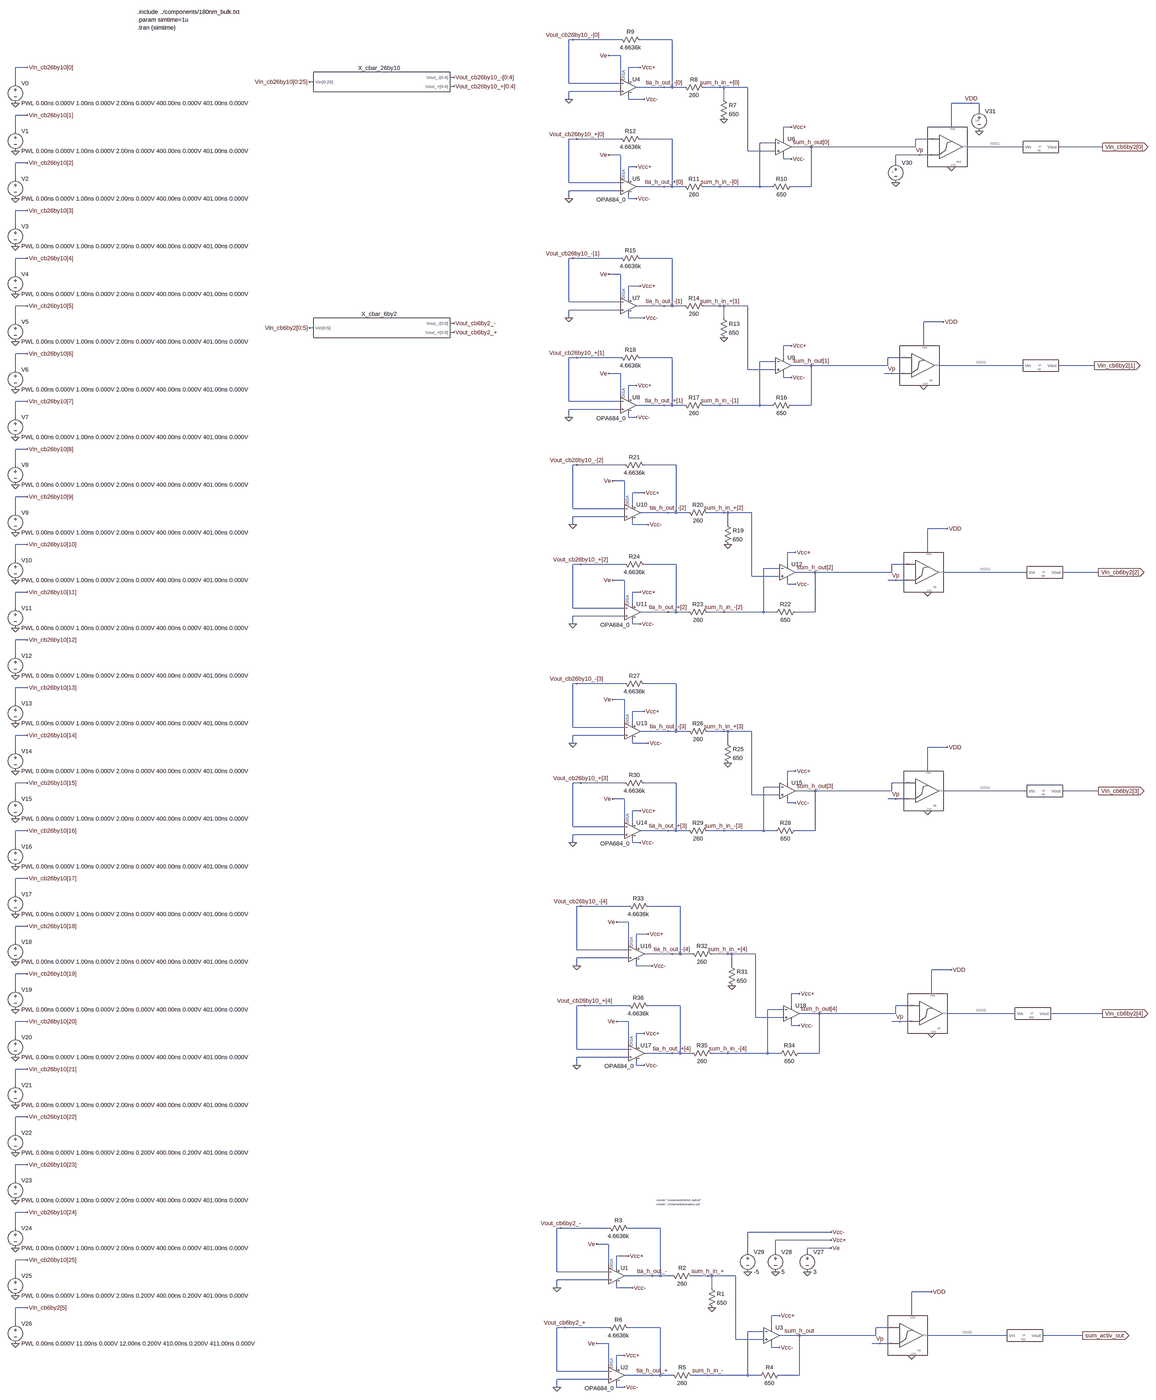
[diagram p0: schematic complete_circuit_generated_4.asc, whole sheet]
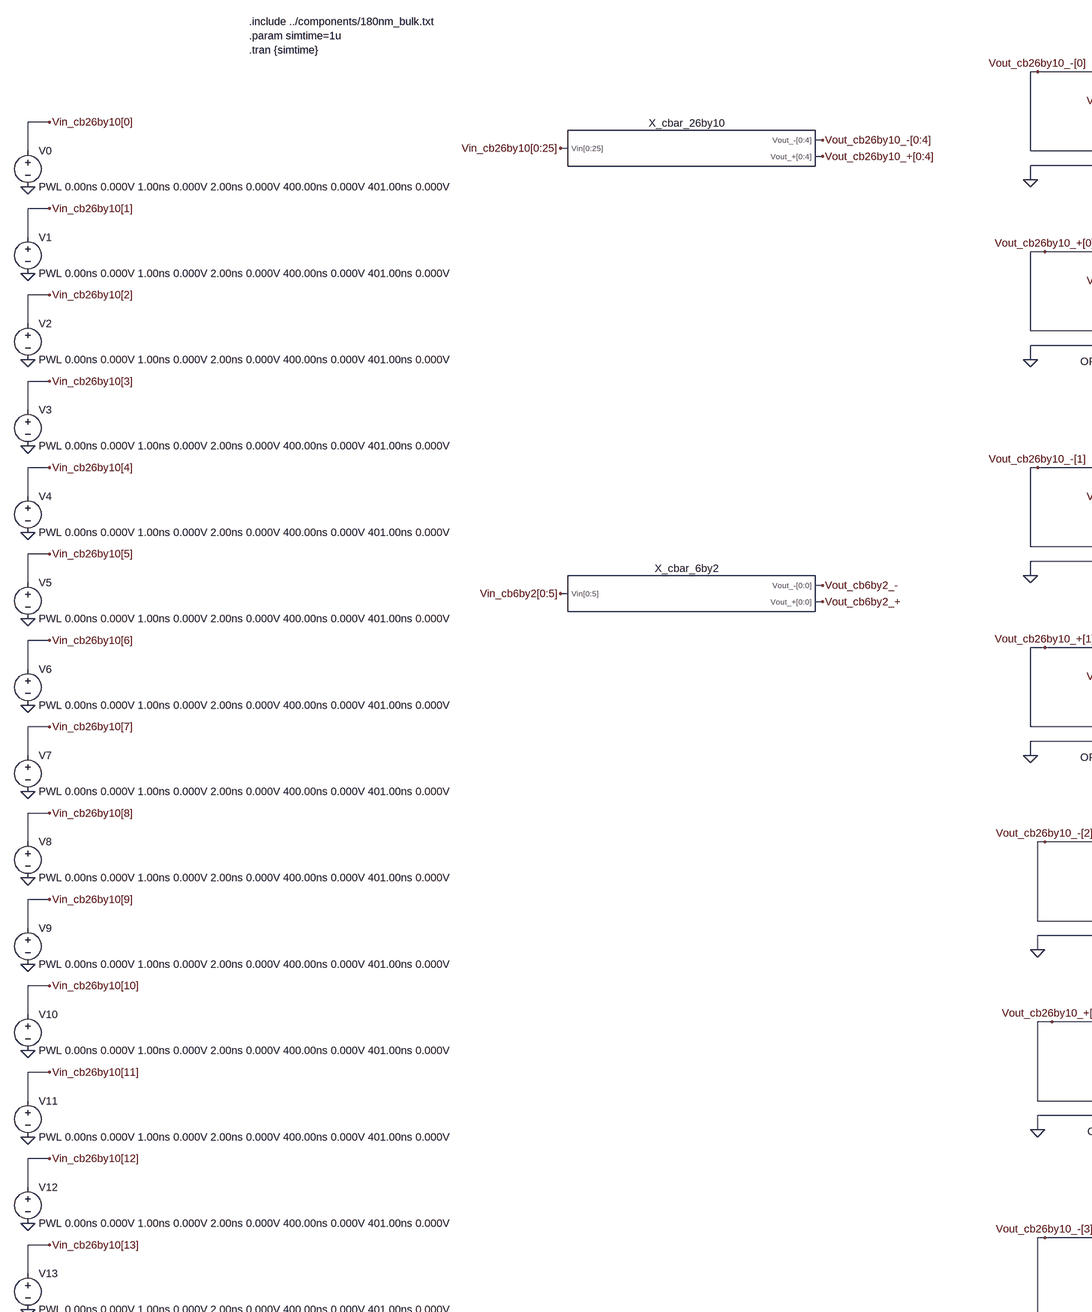
[diagram p1: schematic complete_circuit_generated_4.asc, part, row 1 of 2, column 1 of 2]
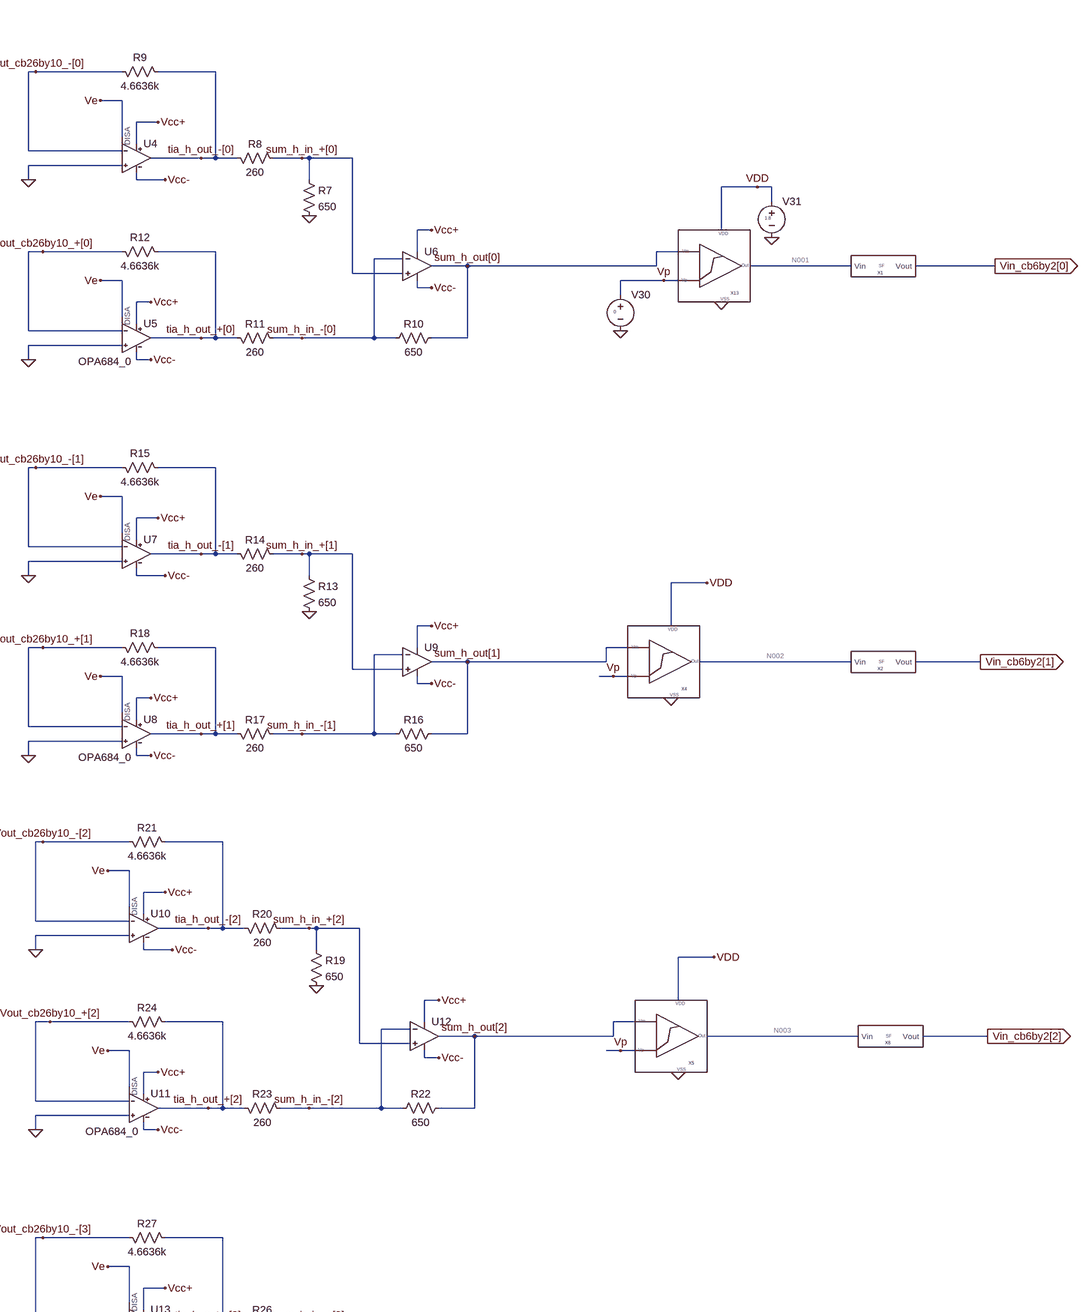
[diagram p2: schematic complete_circuit_generated_4.asc, part, row 1 of 2, column 2 of 2]
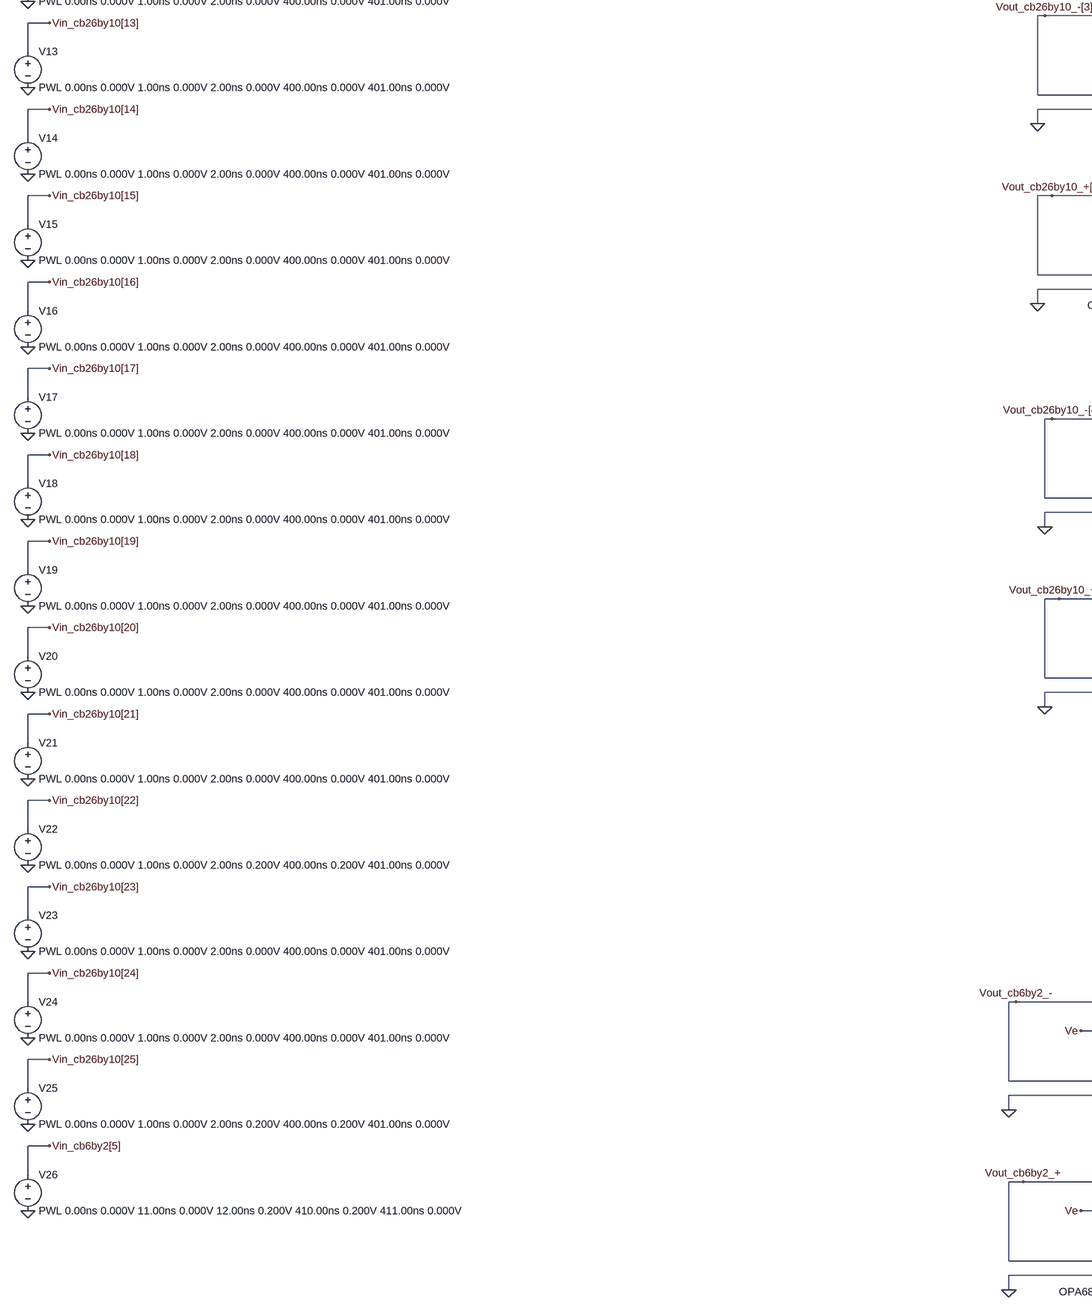
[diagram p3: schematic complete_circuit_generated_4.asc, part, row 2 of 2, column 1 of 2]
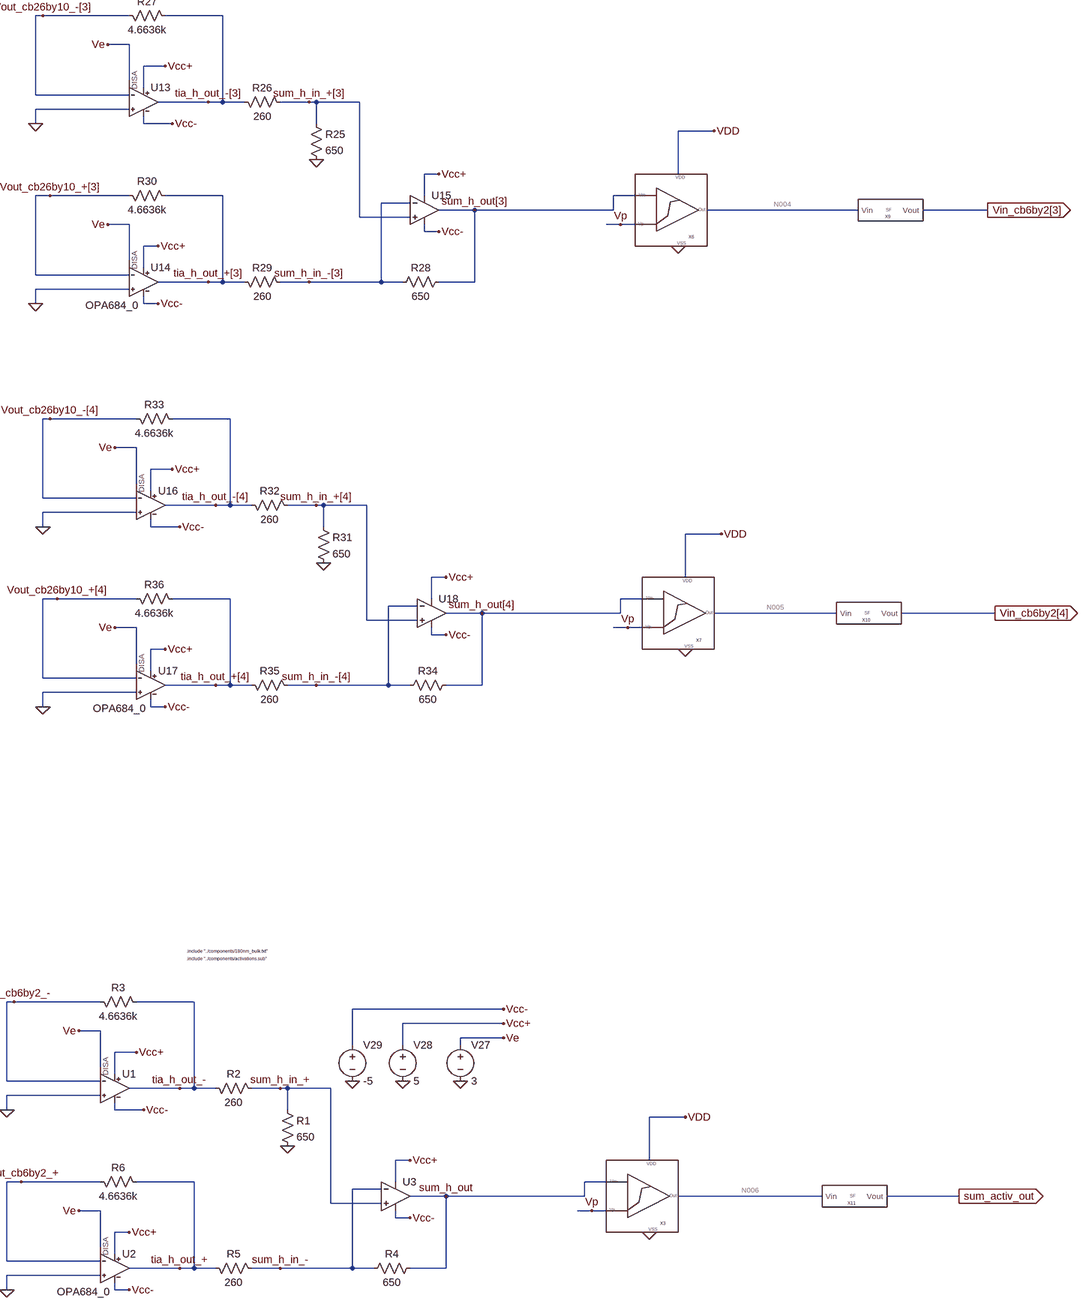
[diagram p4: schematic complete_circuit_generated_4.asc, part, row 2 of 2, column 2 of 2]
* complete_circuit_generated_4.asc
XX_cbar_26by10 Vin_cb26by10[0] Vin_cb26by10[1] Vin_cb26by10[2] Vin_cb26by10[3] Vin_cb26by10[4] Vin_cb26by10[5] Vin_cb26by10[6] Vin_cb26by10[7] Vin_cb26by10[8] Vin_cb26by10[9] Vin_cb26by10[10] Vin_cb26by10[11] Vin_cb26by10[12] Vin_cb26by10[13] Vin_cb26by10[14] Vin_cb26by10[15] Vin_cb26by10[16] Vin_cb26by10[17] Vin_cb26by10[18] Vin_cb26by10[19] Vin_cb26by10[20] Vin_cb26by10[21] Vin_cb26by10[22] Vin_cb26by10[23] Vin_cb26by10[24] Vin_cb26by10[25] Vout_cb26by10_+[0] Vout_cb26by10_+[1] Vout_cb26by10_+[2] Vout_cb26by10_+[3] Vout_cb26by10_+[4] Vout_cb26by10_-[0] Vout_cb26by10_-[1] Vout_cb26by10_-[2] Vout_cb26by10_-[3] Vout_cb26by10_-[4] X_cbar_26by10  ; pins Vin[0:25] Vout_+[0:4] Vout_-[0:4]
XX_cbar_6by2 Vin_cb6by2[0] Vin_cb6by2[1] Vin_cb6by2[2] Vin_cb6by2[3] Vin_cb6by2[4] Vin_cb6by2[5] Vout_cb6by2_+ Vout_cb6by2_- X_cbar_6by2  ; pins Vin[0:5] Vout_+[0:0] Vout_-[0:0]
V0 Vin_cb26by10[0] 0 PWL 0.00ns 0.000V 1.00ns 0.000V 2.00ns 0.000V 400.00ns 0.000V 401.00ns 0.000V
V1 Vin_cb26by10[1] 0 PWL 0.00ns 0.000V 1.00ns 0.000V 2.00ns 0.000V 400.00ns 0.000V 401.00ns 0.000V
V2 Vin_cb26by10[2] 0 PWL 0.00ns 0.000V 1.00ns 0.000V 2.00ns 0.000V 400.00ns 0.000V 401.00ns 0.000V
V3 Vin_cb26by10[3] 0 PWL 0.00ns 0.000V 1.00ns 0.000V 2.00ns 0.000V 400.00ns 0.000V 401.00ns 0.000V
V4 Vin_cb26by10[4] 0 PWL 0.00ns 0.000V 1.00ns 0.000V 2.00ns 0.000V 400.00ns 0.000V 401.00ns 0.000V
V5 Vin_cb26by10[5] 0 PWL 0.00ns 0.000V 1.00ns 0.000V 2.00ns 0.000V 400.00ns 0.000V 401.00ns 0.000V
V6 Vin_cb26by10[6] 0 PWL 0.00ns 0.000V 1.00ns 0.000V 2.00ns 0.000V 400.00ns 0.000V 401.00ns 0.000V
V7 Vin_cb26by10[7] 0 PWL 0.00ns 0.000V 1.00ns 0.000V 2.00ns 0.000V 400.00ns 0.000V 401.00ns 0.000V
V8 Vin_cb26by10[8] 0 PWL 0.00ns 0.000V 1.00ns 0.000V 2.00ns 0.000V 400.00ns 0.000V 401.00ns 0.000V
V9 Vin_cb26by10[9] 0 PWL 0.00ns 0.000V 1.00ns 0.000V 2.00ns 0.000V 400.00ns 0.000V 401.00ns 0.000V
V10 Vin_cb26by10[10] 0 PWL 0.00ns 0.000V 1.00ns 0.000V 2.00ns 0.000V 400.00ns 0.000V 401.00ns 0.000V
V11 Vin_cb26by10[11] 0 PWL 0.00ns 0.000V 1.00ns 0.000V 2.00ns 0.000V 400.00ns 0.000V 401.00ns 0.000V
V12 Vin_cb26by10[12] 0 PWL 0.00ns 0.000V 1.00ns 0.000V 2.00ns 0.000V 400.00ns 0.000V 401.00ns 0.000V
V13 Vin_cb26by10[13] 0 PWL 0.00ns 0.000V 1.00ns 0.000V 2.00ns 0.000V 400.00ns 0.000V 401.00ns 0.000V
V14 Vin_cb26by10[14] 0 PWL 0.00ns 0.000V 1.00ns 0.000V 2.00ns 0.000V 400.00ns 0.000V 401.00ns 0.000V
V15 Vin_cb26by10[15] 0 PWL 0.00ns 0.000V 1.00ns 0.000V 2.00ns 0.000V 400.00ns 0.000V 401.00ns 0.000V
V16 Vin_cb26by10[16] 0 PWL 0.00ns 0.000V 1.00ns 0.000V 2.00ns 0.000V 400.00ns 0.000V 401.00ns 0.000V
V17 Vin_cb26by10[17] 0 PWL 0.00ns 0.000V 1.00ns 0.000V 2.00ns 0.000V 400.00ns 0.000V 401.00ns 0.000V
V18 Vin_cb26by10[18] 0 PWL 0.00ns 0.000V 1.00ns 0.000V 2.00ns 0.000V 400.00ns 0.000V 401.00ns 0.000V
V19 Vin_cb26by10[19] 0 PWL 0.00ns 0.000V 1.00ns 0.000V 2.00ns 0.000V 400.00ns 0.000V 401.00ns 0.000V
V20 Vin_cb26by10[20] 0 PWL 0.00ns 0.000V 1.00ns 0.000V 2.00ns 0.000V 400.00ns 0.000V 401.00ns 0.000V
V21 Vin_cb26by10[21] 0 PWL 0.00ns 0.000V 1.00ns 0.000V 2.00ns 0.000V 400.00ns 0.000V 401.00ns 0.000V
V22 Vin_cb26by10[22] 0 PWL 0.00ns 0.000V 1.00ns 0.000V 2.00ns 0.200V 400.00ns 0.200V 401.00ns 0.000V
V23 Vin_cb26by10[23] 0 PWL 0.00ns 0.000V 1.00ns 0.000V 2.00ns 0.000V 400.00ns 0.000V 401.00ns 0.000V
V24 Vin_cb26by10[24] 0 PWL 0.00ns 0.000V 1.00ns 0.000V 2.00ns 0.000V 400.00ns 0.000V 401.00ns 0.000V
V25 Vin_cb26by10[25] 0 PWL 0.00ns 0.000V 1.00ns 0.000V 2.00ns 0.200V 400.00ns 0.200V 401.00ns 0.000V
V26 Vin_cb6by2[5] 0 PWL 0.00ns 0.000V 11.00ns 0.000V 12.00ns 0.200V 410.00ns 0.200V 411.00ns 0.000V
R1 sum_h_in_+ 0 650
R2 sum_h_in_+ tia_h_out_- 260
R3 tia_h_out_- Vout_cb6by2_- 4.6636k
XU1 0 Vout_cb6by2_- Vcc+ Vcc- tia_h_out_- Ve OPA684_0  ; pins In+ In- V+ V- OUT DISA
V27 Ve 0 3
V28 Vcc+ 0 5
V29 Vcc- 0 -5
R4 sum_h_out sum_h_in_- 650
R5 sum_h_in_- tia_h_out_+ 260
R6 tia_h_out_+ Vout_cb6by2_+ 4.6636k
XU2 0 Vout_cb6by2_+ Vcc+ Vcc- tia_h_out_+ Ve OPA684_0  ; pins In+ In- V+ V- OUT DISA
XU3 sum_h_in_+ sum_h_in_- Vcc+ Vcc- sum_h_out MAX4223  ; pins In+ In- V+ V- OUT
R7 sum_h_in_+[0] 0 650
R8 sum_h_in_+[0] tia_h_out_-[0] 260
R9 tia_h_out_-[0] Vout_cb26by10_-[0] 4.6636k
XU4 0 Vout_cb26by10_-[0] Vcc+ Vcc- tia_h_out_-[0] Ve OPA684_0  ; pins In+ In- V+ V- OUT DISA
R10 sum_h_out[0] sum_h_in_-[0] 650
R11 sum_h_in_-[0] tia_h_out_+[0] 260
R12 tia_h_out_+[0] Vout_cb26by10_+[0] 4.6636k
XU5 0 Vout_cb26by10_+[0] Vcc+ Vcc- tia_h_out_+[0] Ve OPA684_0  ; pins In+ In- V+ V- OUT DISA
XU6 sum_h_in_+[0] sum_h_in_-[0] Vcc+ Vcc- sum_h_out[0] MAX4223  ; pins In+ In- V+ V- OUT
R13 sum_h_in_+[1] 0 650
R14 sum_h_in_+[1] tia_h_out_-[1] 260
R15 tia_h_out_-[1] Vout_cb26by10_-[1] 4.6636k
XU7 0 Vout_cb26by10_-[1] Vcc+ Vcc- tia_h_out_-[1] Ve OPA684_0  ; pins In+ In- V+ V- OUT DISA
R16 sum_h_out[1] sum_h_in_-[1] 650
R17 sum_h_in_-[1] tia_h_out_+[1] 260
R18 tia_h_out_+[1] Vout_cb26by10_+[1] 4.6636k
XU8 0 Vout_cb26by10_+[1] Vcc+ Vcc- tia_h_out_+[1] Ve OPA684_0  ; pins In+ In- V+ V- OUT DISA
XU9 sum_h_in_+[1] sum_h_in_-[1] Vcc+ Vcc- sum_h_out[1] MAX4223  ; pins In+ In- V+ V- OUT
R19 sum_h_in_+[2] 0 650
R20 sum_h_in_+[2] tia_h_out_-[2] 260
R21 tia_h_out_-[2] Vout_cb26by10_-[2] 4.6636k
XU10 0 Vout_cb26by10_-[2] Vcc+ Vcc- tia_h_out_-[2] Ve OPA684_0  ; pins In+ In- V+ V- OUT DISA
R22 sum_h_out[2] sum_h_in_-[2] 650
R23 sum_h_in_-[2] tia_h_out_+[2] 260
R24 tia_h_out_+[2] Vout_cb26by10_+[2] 4.6636k
XU11 0 Vout_cb26by10_+[2] Vcc+ Vcc- tia_h_out_+[2] Ve OPA684_0  ; pins In+ In- V+ V- OUT DISA
XU12 sum_h_in_+[2] sum_h_in_-[2] Vcc+ Vcc- sum_h_out[2] MAX4223  ; pins In+ In- V+ V- OUT
R25 sum_h_in_+[3] 0 650
R26 sum_h_in_+[3] tia_h_out_-[3] 260
R27 tia_h_out_-[3] Vout_cb26by10_-[3] 4.6636k
XU13 0 Vout_cb26by10_-[3] Vcc+ Vcc- tia_h_out_-[3] Ve OPA684_0  ; pins In+ In- V+ V- OUT DISA
R28 sum_h_out[3] sum_h_in_-[3] 650
R29 sum_h_in_-[3] tia_h_out_+[3] 260
R30 tia_h_out_+[3] Vout_cb26by10_+[3] 4.6636k
XU14 0 Vout_cb26by10_+[3] Vcc+ Vcc- tia_h_out_+[3] Ve OPA684_0  ; pins In+ In- V+ V- OUT DISA
XU15 sum_h_in_+[3] sum_h_in_-[3] Vcc+ Vcc- sum_h_out[3] MAX4223  ; pins In+ In- V+ V- OUT
R31 sum_h_in_+[4] 0 650
R32 sum_h_in_+[4] tia_h_out_-[4] 260
R33 tia_h_out_-[4] Vout_cb26by10_-[4] 4.6636k
XU16 0 Vout_cb26by10_-[4] Vcc+ Vcc- tia_h_out_-[4] Ve OPA684_0  ; pins In+ In- V+ V- OUT DISA
R34 sum_h_out[4] sum_h_in_-[4] 650
R35 sum_h_in_-[4] tia_h_out_+[4] 260
R36 tia_h_out_+[4] Vout_cb26by10_+[4] 4.6636k
XU17 0 Vout_cb26by10_+[4] Vcc+ Vcc- tia_h_out_+[4] Ve OPA684_0  ; pins In+ In- V+ V- OUT DISA
XU18 sum_h_in_+[4] sum_h_in_-[4] Vcc+ Vcc- sum_h_out[4] MAX4223  ; pins In+ In- V+ V- OUT
XX13 sum_h_out[0] Vp VDD 0 N001 comparator  ; pins Vm Vp VDD VSS Out
V30 Vp 0 0
V31 VDD 0 1.8
XX3 sum_h_out Vp VDD 0 N006 comparator  ; pins Vm Vp VDD VSS Out
XX4 sum_h_out[1] Vp VDD 0 N002 comparator  ; pins Vm Vp VDD VSS Out
XX5 sum_h_out[2] Vp VDD 0 N003 comparator  ; pins Vm Vp VDD VSS Out
XX6 sum_h_out[3] Vp VDD 0 N004 comparator  ; pins Vm Vp VDD VSS Out
XX7 sum_h_out[4] Vp VDD 0 N005 comparator  ; pins Vm Vp VDD VSS Out
XX1 N001 Vin_cb6by2[0] sourceFollower  ; pins Vin Vout
XX2 N002 Vin_cb6by2[1] sourceFollower  ; pins Vin Vout
XX8 N003 Vin_cb6by2[2] sourceFollower  ; pins Vin Vout
XX9 N004 Vin_cb6by2[3] sourceFollower  ; pins Vin Vout
XX10 N005 Vin_cb6by2[4] sourceFollower  ; pins Vin Vout
XX11 N006 sum_activ_out sourceFollower  ; pins Vin Vout
.tran {simtime}
.param simtime=1u
.include ../components/180nm_bulk.txt
.include "../components/activations.sub"
.include "../components/180nm_bulk.txt"
.backanno
.end

* Results of the author's LTspice run, read from the files saved beside the schematic
* Operating Point, zero values left out:
*   V(vout_cb26by10_+[0]) = -426.9 µV
*   V(vout_cb26by10_-[0]) = -426.9 µV
*   V(vout_cb26by10_+[1]) = -426.9 µV
*   V(vout_cb26by10_-[1]) = -426.9 µV
*   V(vout_cb26by10_+[2]) = -426.9 µV
*   V(vout_cb26by10_-[2]) = -426.9 µV
*   V(vout_cb26by10_+[3]) = -426.9 µV
*   V(vout_cb26by10_-[3]) = -426.9 µV
*   V(vout_cb26by10_+[4]) = -426.9 µV
*   V(vout_cb26by10_-[4]) = -426.9 µV
*   V(vin_cb6by2[0]) = 1.549 µV
*   V(vout_cb6by2_+) = -426.9 µV
*   V(vout_cb6by2_-) = -426.9 µV
*   V(vin_cb6by2[1]) = 1.549 µV
*   V(vin_cb6by2[2]) = 1.549 µV
*   V(vin_cb6by2[3]) = 1.549 µV
*   V(vin_cb6by2[4]) = 1.549 µV
*   V(sum_h_in_+) = 10.77 mV
*   V(tia_h_out_-) = 15.99 mV
*   V(ve) = 3 V
*   V(vcc-) = -5 V
*   V(vcc+) = 5 V
*   V(sum_h_out) = -5.794 mV
*   V(sum_h_in_-) = 10.75 mV
*   V(tia_h_out_+) = 16.45 mV
*   V(sum_h_in_+[0]) = 8.859 mV
*   V(tia_h_out_-[0]) = 13.31 mV
*   V(sum_h_out[0]) = -6.16 mV
*   V(sum_h_in_-[0]) = 8.836 mV
*   V(tia_h_out_+[0]) = 13.92 mV
*   V(sum_h_in_+[1]) = 7.991 mV
*   V(tia_h_out_-[1]) = 12.1 mV
*   V(sum_h_out[1]) = -8.868 mV
*   V(sum_h_in_-[1]) = 7.97 mV
*   V(tia_h_out_+[1]) = 13.8 mV
*   V(sum_h_in_+[2]) = 8.244 mV
*   V(tia_h_out_-[2]) = 12.45 mV
*   V(sum_h_out[2]) = -8.093 mV
*   V(sum_h_in_-[2]) = 8.223 mV
*   V(tia_h_out_+[2]) = 13.84 mV
*   V(sum_h_in_+[3]) = 9.119 mV
*   V(tia_h_out_-[3]) = 13.68 mV
*   V(sum_h_out[3]) = -5.305 mV
*   V(sum_h_in_-[3]) = 9.095 mV
*   V(tia_h_out_+[3]) = 13.95 mV
*   V(sum_h_in_+[4]) = 9.334 mV
*   V(tia_h_out_-[4]) = 13.98 mV
*   V(sum_h_out[4]) = 138.3 µV
*   V(sum_h_in_-[4]) = 9.309 mV
*   V(tia_h_out_+[4]) = 12.07 mV
*   V(vdd) = 1.8 V
*   V(n001) = 1.549 µV
*   V(n006) = 1.549 µV
*   V(n002) = 1.549 µV
*   V(n003) = 1.549 µV
*   V(n004) = 1.549 µV
*   V(n005) = 1.549 µV
*   V(sum_activ_out) = 1.549 µV
*   I(R1) = 16.57 µA
*   I(R2) = -20.08 µA
*   I(R3) = 3.521 µA
*   I(R4) = -25.45 µA
*   I(R5) = -21.95 µA
*   I(R6) = 3.619 µA
*   I(R7) = 13.63 µA
*   I(R8) = -17.13 µA
*   I(R9) = 2.946 µA
*   I(R10) = -23.07 µA
*   I(R11) = -19.57 µA
*   I(R12) = 3.077 µA
*   I(R13) = 12.29 µA
*   I(R14) = -15.79 µA
*   I(R15) = 2.686 µA
*   I(R16) = -25.9 µA
*   I(R17) = -22.41 µA
*   I(R18) = 3.05 µA
*   I(R19) = 12.68 µA
*   I(R20) = -16.18 µA
*   I(R21) = 2.762 µA
*   I(R22) = -25.1 µA
*   I(R23) = -21.6 µA
*   I(R24) = 3.059 µA
*   I(R25) = 14.03 µA
*   I(R26) = -17.53 µA
*   I(R27) = 3.024 µA
*   I(R28) = -22.15 µA
*   I(R29) = -18.66 µA
*   I(R30) = 3.082 µA
*   I(R31) = 14.36 µA
*   I(R32) = -17.86 µA
*   I(R33) = 3.089 µA
*   I(R34) = -14.11 µA
*   I(R35) = -10.61 µA
*   I(R36) = 2.679 µA
*   I(V0) = -329.3 nA
*   I(V1) = -345.9 nA
*   I(V2) = -345 nA
*   I(V3) = -334.6 nA
*   I(V4) = -338.9 nA
*   I(V5) = -334.7 nA
*   I(V6) = -345.7 nA
*   I(V7) = -337.1 nA
*   I(V8) = -342.1 nA
*   I(V9) = -341.2 nA
*   I(V10) = -349.9 nA
*   I(V11) = -337.5 nA
*   I(V12) = -336.6 nA
*   I(V13) = -339.9 nA
*   I(V14) = -351.8 nA
*   I(V15) = -343.4 nA
*   I(V16) = -344.5 nA
*   I(V17) = -345.3 nA
*   I(V18) = -347.5 nA
*   I(V19) = -334.7 nA
*   I(V20) = -350.1 nA
*   I(V21) = -343.5 nA
*   I(V22) = -341 nA
*   I(V23) = -341.6 nA
*   I(V24) = -334.1 nA
*   I(V25) = -414.5 nA
*   I(V26) = -76.5 nA
*   I(V27) = -33.63 nA
*   I(V28) = -38.3 mA
*   I(V29) = 26.24 mA
*   I(V31) = -1.692 mA
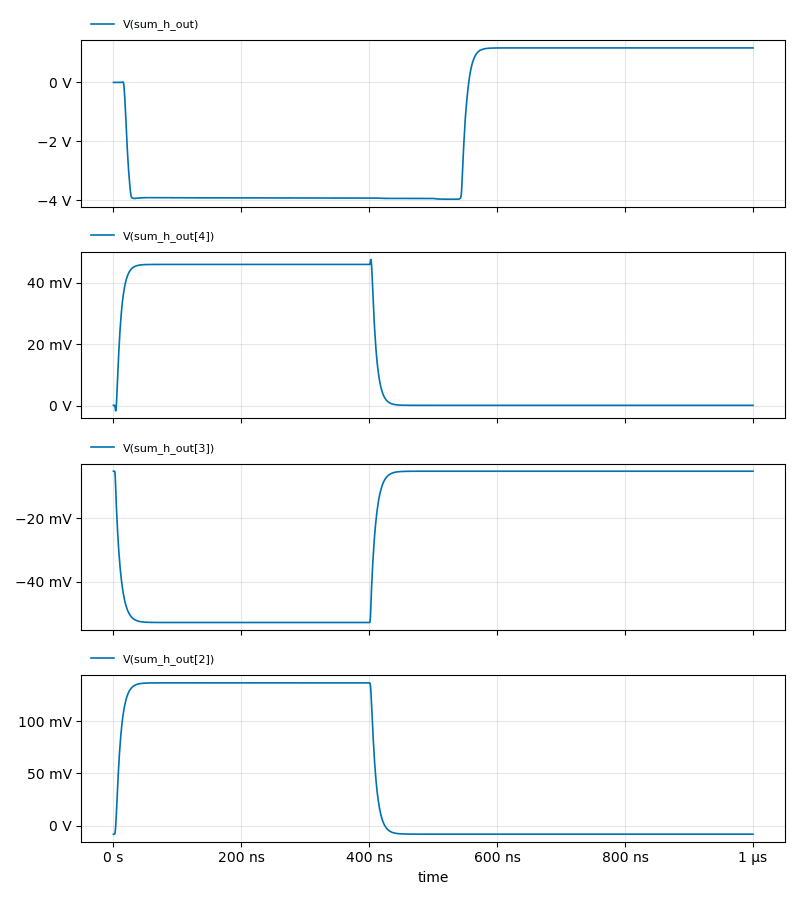
[diagram p5: Transient Analysis of complete_circuit_generated_4.asc, plotted from the saved traces]
* Transient Analysis, 1 run:
*   V(sum_h_out): min -3.964 V, max 1.163 V, average -1.561 V, rms 2.942 V, last 1.163 V
*   V(sum_h_out[4]): min -1.661 mV, max 47.62 mV, average 18.46 mV, rms 28.84 mV, last 138.3 µV
*   V(sum_h_out[3]): min -52.75 mV, max -5.305 mV, average -24.24 mV, rms 33.32 mV, last -5.305 mV
*   V(sum_h_out[2]): min -8.094 mV, max 136.7 mV, average 49.72 mV, rms 85.7 mV, last -8.093 mV